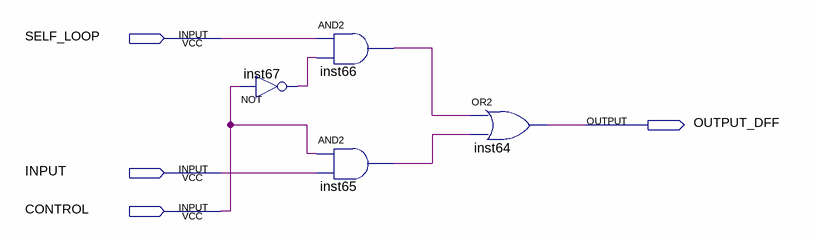
[diagram p0: schematic sheet]
// Quartus schematic SELF_LOOP.bdf as structural Verilog: 4 symbols, 4 pins
module SELF_LOOP (
  input  SELF_LOOP,
  input  INPUT,
  input  CONTROL,
  output OUTPUT_DFF
);

  wire inst65_out, inst66_out, inst67_out;

  not inst67 (inst67_out, CONTROL);
  and inst66 (inst66_out, SELF_LOOP, inst67_out);
  and inst65 (inst65_out, CONTROL, INPUT);
  or inst64 (OUTPUT_DFF, inst66_out, inst65_out);
endmodule
